# Altium schematic sheet control_servo_schematic.SchDoc
size A3
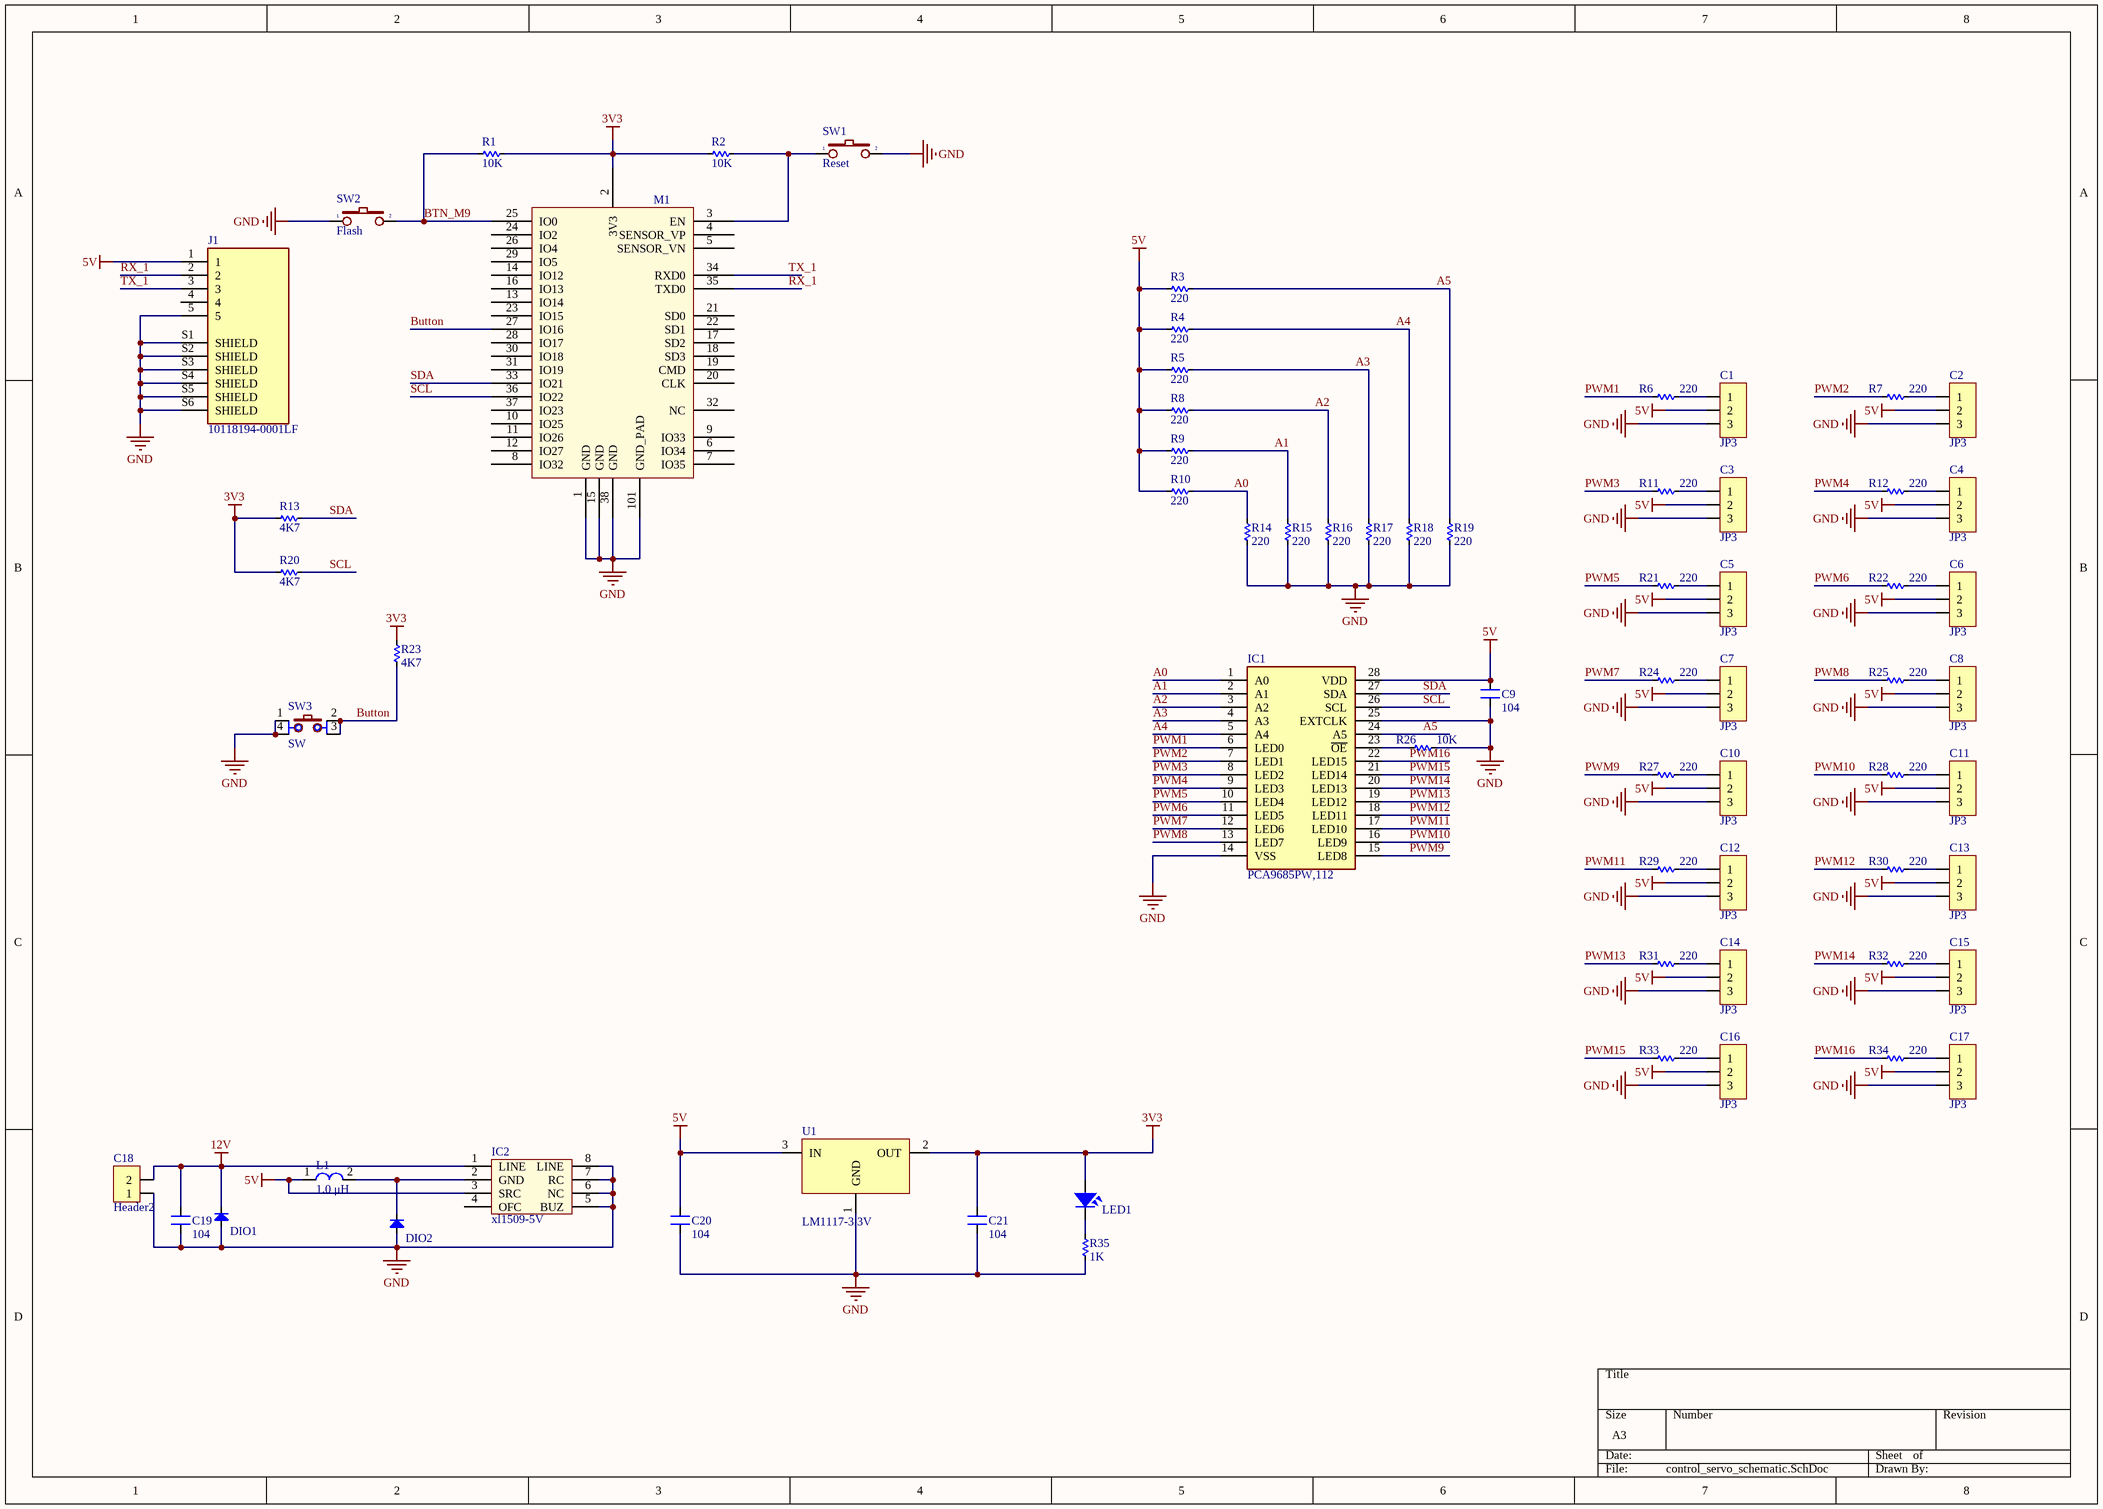
[diagram p0: control_servo_schematic.SchDoc]

## Parts
C1  JP3  [JP3-D1T]
C2  JP3  [JP3-D1T]
C3  JP3  [JP3-D1T]
C4  JP3  [JP3-D1T]
C5  JP3  [JP3-D1T]
C6  JP3  [JP3-D1T]
C7  JP3  [JP3-D1T]
C8  JP3  [JP3-D1T]
C9  104  [SM-CAP-0805]
C10  JP3  [JP3-D1T]
C11  JP3  [JP3-D1T]
C12  JP3  [JP3-D1T]
C13  JP3  [JP3-D1T]
C14  JP3  [JP3-D1T]
C15  JP3  [JP3-D1T]
C16  JP3  [JP3-D1T]
C17  JP3  [JP3-D1T]
C18  Header2  [Header2]
C19  104  [SM-CAP-0805]
C20  104  [SM-CAP-0805]
C21  104  [SM-CAP-0805]
DIO1  Diode SMD  [DIO-SMD-106]  (value not drawn)
DIO2  Diode SMD  [DIO-SMD-106]  (value not drawn)
IC1  PCA9685PW,112  [SOP65P640X110-28N]
IC2  xl1509-5V  [SO-8]
J1  10118194-0001LF  [AMPHENOL_10118194-0001LF]
L1  1.0 μH  [L-SMD-M-7.3x4.5]
LED1  LED  [LED-0805-Blue]  (value not drawn)
M1  ESP32S_Module  [ESP32S]  (value not drawn)
R1  10K  [RES-SMD-0603]
R2  10K  [RES-SMD-0603]
R3  220  [RES-SMD-0603]
R4  220  [RES-SMD-0603]
R5  220  [RES-SMD-0603]
R6  220  [RES-SMD-0603]
R7  220  [RES-SMD-0603]
R8  220  [RES-SMD-0603]
R9  220  [RES-SMD-0603]
R10  220  [RES-SMD-0603]
R11  220  [RES-SMD-0603]
R12  220  [RES-SMD-0603]
R13  4K7  [RES-SMD-0603]
R14  220  [RES-SMD-0603]
R15  220  [RES-SMD-0603]
R16  220  [RES-SMD-0603]
R17  220  [RES-SMD-0603]
R18  220  [RES-SMD-0603]
R19  220  [RES-SMD-0603]
R20  4K7  [RES-SMD-0603]
R21  220  [RES-SMD-0603]
R22  220  [RES-SMD-0603]
R23  4K7  [RES-SMD-0603]
R24  220  [RES-SMD-0603]
R25  220  [RES-SMD-0603]
R26  10K  [RES-SMD-0603]
R27  220  [RES-SMD-0603]
R28  220  [RES-SMD-0603]
R29  220  [RES-SMD-0603]
R30  220  [RES-SMD-0603]
R31  220  [RES-SMD-0603]
R32  220  [RES-SMD-0603]
R33  220  [RES-SMD-0603]
R34  220  [RES-SMD-0603]
R35  1K  [RES-SMD-0603]
SW1  Reset  [SW1-SMD]
SW2  Flash  [SW-DIP1-1]
SW3  SW  [SW2-SMD]
U1  LM1117-3.3V  [SOT223]

## Nets
3V3: C21.2 LED1.1 M1.2(3V3) R1.1 R2.2 R13.1 R20.1 R23.2 U1.2(OUT)
5V: C1.2 C2.2 C3.2 C4.2 C5.2 C6.2 C7.2 C8.2 C9.2 C10.2 C11.2 C12.2 C13.2 C14.2 C15.2 C16.2 C17.2 C20.2 IC1.28(VDD) IC2.3(SRC) J1.1 L1.1 R3.1 R4.1 R5.1 R8.1 R9.1 R10.1 U1.3(IN)
12V: C18.2 C19.2 DIO1.2(K) IC2.1(LINE)
GND: C1.3 C2.3 C3.3 C4.3 C5.3 C6.3 C7.3 C8.3 C9.1 C10.3 C11.3 C12.3 C13.3 C14.3 C15.3 C16.3 C17.3 C18.1 C19.1 C20.1 C21.1 DIO1.1(A) DIO2.1(A) IC1.14(VSS) IC1.25(EXTCLK) IC2.5(BUZ) IC2.6(NC) IC2.7(RC) IC2.8(LINE) J1.5 J1.S1(SHIELD) J1.S2(SHIELD) J1.S3(SHIELD) J1.S4(SHIELD) J1.S5(SHIELD) J1.S6(SHIELD) M1.1(GND) M1.15(GND) M1.38(GND) M1.101(GND_PAD) R14.2 R15.2 R16.2 R17.2 R18.2 R19.2 R26.1 R35.2 SW1.2 SW2.1 SW3.1 SW3.4 U1.1(GND)
A0: IC1.1(A0) R10.2 R14.1
A1: IC1.2(A1) R9.2 R15.1
A2: IC1.3(A2) R8.2 R16.1
A3: IC1.4(A3) R5.2 R17.1
A4: IC1.5(A4) R4.2 R18.1
A5: IC1.24(A5) R3.2 R19.1
BTN_M9: M1.25(IO0) R1.2 SW2.2
Button: M1.27(IO16) R23.1 SW3.2 SW3.3
PWM1: IC1.6(LED0) R6.2
PWM2: IC1.7(LED1) R7.2
PWM3: IC1.8(LED2) R11.2
PWM4: IC1.9(LED3) R12.2
PWM5: IC1.10(LED4) R21.2
PWM6: IC1.11(LED5) R22.2
PWM7: IC1.12(LED6) R24.2
PWM8: IC1.13(LED7) R25.2
PWM9: IC1.15(LED8) R27.2
PWM10: IC1.16(LED9) R28.2
PWM11: IC1.17(LED10) R29.2
PWM12: IC1.18(LED11) R30.2
PWM13: IC1.19(LED12) R31.2
PWM14: IC1.20(LED13) R32.2
PWM15: IC1.21(LED14) R33.2
PWM16: IC1.22(LED15) R34.2
RX_1: J1.2 M1.35(TXD0)
SCL: IC1.26(SCL) M1.36(IO22) R20.2
SDA: IC1.27(SDA) M1.33(IO21) R13.2
TX_1: J1.3 M1.34(RXD0)
NetC1_1: C1.1 R6.1
NetC2_1: C2.1 R7.1
NetC3_1: C3.1 R11.1
NetC4_1: C4.1 R12.1
NetC5_1: C5.1 R21.1
NetC6_1: C6.1 R22.1
NetC7_1: C7.1 R24.1
NetC8_1: C8.1 R25.1
NetC10_1: C10.1 R27.1
NetC11_1: C11.1 R28.1
NetC12_1: C12.1 R29.1
NetC13_1: C13.1 R30.1
NetC14_1: C14.1 R31.1
NetC15_1: C15.1 R32.1
NetC16_1: C16.1 R33.1
NetC17_1: C17.1 R34.1
NetDIO2_2: DIO2.2(K) IC2.2(GND) L1.2
NetIC1_23: IC1.23(~{OE}) R26.2
NetLED1_2: LED1.2 R35.1
NetM1_3: M1.3(EN) R2.1 SW1.1

Not connected (* = marked no-connect by the designer): IC2 4(OFC); J1 4; M1 4(SENSOR_VP) 5(SENSOR_VN) 6(IO34) 7(IO35) 8(IO32) 9(IO33) 10(IO25) 11(IO26) 12(IO27) 13(IO14) 14(IO12) 16(IO13) 17(SD2) 18(SD3) 19(CMD) 20(CLK) 21(SD0) 22(SD1) 23(IO15) 24(IO2) 26(IO4) 28(IO17) 29(IO5) 30(IO18) 31(IO19) 32(NC) 37(IO23)

## Library data of the parts
C1-C8 C10-C17 = JP3: WR-PHD 2.54 mm Angled Socket Header; Manufacturer: W¨¹rth Elektronik eiSos GmbH; partNo: 613003143121; ComponentLink1 Description: Manufacturer; ComponentLink2 Description: Datasheet; NoPins: 03; Created Date: 29 March 2013; ComponentLink1URL: http://www.we-online.com; ComponentLink2URL: http://katalog.we-online.de/em/datasheet/6130xx143121.pdf; Created by: Karrer Zheng
C9 C19-C21 = CN: Value: 0,1uF/300V; Designed by: VanDungEvn
C18 = Header2: Header IDC, 2 x 1 Pin Vertical 2.54mm Pitch (Non-Boxed, Male); Manufacturer: W¨¹rth Elektronik eiSos GmbH; partNo: 613002143121; ComponentLink1 Description: Manufacturer; ComponentLink2 Description: Datasheet; NoPins: 02; Created Date: 29 March 2013; ComponentLink1URL: http://www.we-online.com; ComponentLink2URL: http://katalog.we-online.de/em/datasheet/6130xx143121.pdf; Created by: Karrer Zheng
DIO1 DIO2 = Diode SMD: Default Diode; Code - JEDEC: DO-214-AB; Value: 1N5007; Published: 8-Jun-2000; Revision: July-2002: Re-released for DXP Platform.; Publisher: Altium Limited
IC1 = PCA9685PW,112: Integrated Circuit; Manufacturer_Name: NXP; Datasheet Link: http://www.nxp.com/docs/en/data-sheet/PCA9685.pdf; Height: 1.1mm; Manufacturer_Part_Number: PCA9685PW,112; Mouser Part Number: 771-PCA9685PW,112; Mouser Price/Stock: https://www.mouser.co.uk/ProductDetail/NXP-Semiconductors/PCA9685PW112?qs=6YAT8rHPFU9wZqiAeiOMZw%3D%3D; Arrow Part Number: PCA9685PW,112; Arrow Price/Stock: https://www.arrow.com/en/products/pca9685pw112/nxp-semiconductors?region=nac
IC2 = LS1240A: Electronic Two-Tone Ringer
J1 = 10118194-0001LF: USB - micro B USB 2.0 Receptacle Connector 5 Position Surface Mount, Right Angle; Through Hole; MF: Amphenol ICC; Package: None; Price: None; Availability: Unavailable; MP: 10118194-0001LF; SnapEDA_Link: https://www.snapeda.com/parts/10118194-0001LF/Amphenol%20FCI/view-part/1413308/?ref=snap; Value: *
L1 = L-SMD-1: partNo: 78477010; Manufacturer: Wurth Elektronik; Inductance: 1.0 μH; ComponentLink1Description: Manufacturer; ComponentLink1URL: http://www.we-online.de; Created by: Baojun Chen; Created Date: Nov.2015; ComponentLink2Description: Datasheet; ComponentLink2URL: http://katalog.we-online.de/pbs/datasheet/78477010.pdf
LED1 = LED SMD: Value: LED 3 - 5 ly 2 Colour
M1 = ESP32S_Module: Esp-32S; Datasheet: https://espressif.com/sites/default/files/documentation/esp_wroom_32_datasheet_en.pdf
R1-R35 = Res-SMD: Resistor; Manufacturer: Generic Components; Class: Passive; Published: 08/06/2000; Publisher: Altium Hobart Technology Centre
SW1 SW2 = SW2: Switch button 2 pin; Value: SW chip 2 pin
SW3 = SW4: Switch button 4 pin; Value: Button chip 4 pin
U1 = LM1117: 800mA Low-Dropout Linear Regulator; Creator: Nguyen Ba Bien; Website: http://group3i.net